# EAGLE design rf24 shield (EAGLE 6.1)
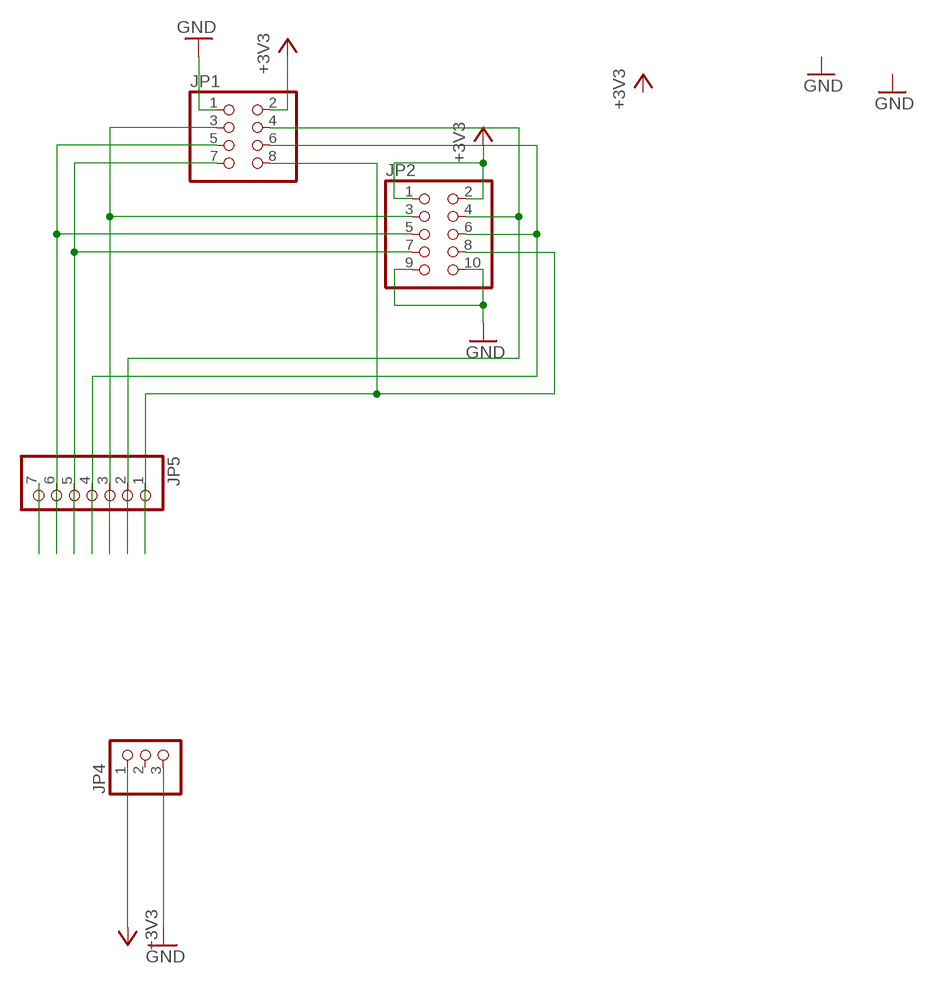
[diagram p0: schematic, sheet 1]

## Parts
JP1  PINHD-2X4  [2X04]
JP2  PINHD-2X5  [2X05]
JP4  PINHD-1X3  [1X03]
JP5  PINHD-1X7  [1X07]

## Nets
+3V3: JP1.2 JP2.1 JP2.2 JP4.1
GND: JP1.1 JP2.9 JP2.10 JP4.3
N$1: JP1.3 JP2.3 JP5.3
N$2: JP1.5 JP2.5 JP5.6
N$3: JP1.7 JP2.7 JP5.5
N$4: JP1.4 JP2.4 JP5.2
N$5: JP1.6 JP2.6 JP5.4
N$6: JP1.8 JP2.8 JP5.1
N$8: JP5.7
Unconnected: JP4.2

## Library data of the parts
JP1 = pinhead:PINHD-2X4: PIN HEADER
JP2 = pinhead:PINHD-2X5: PIN HEADER
JP4 = pinhead:PINHD-1X3: PIN HEADER
JP5 = pinhead:PINHD-1X7: PIN HEADER

## Board
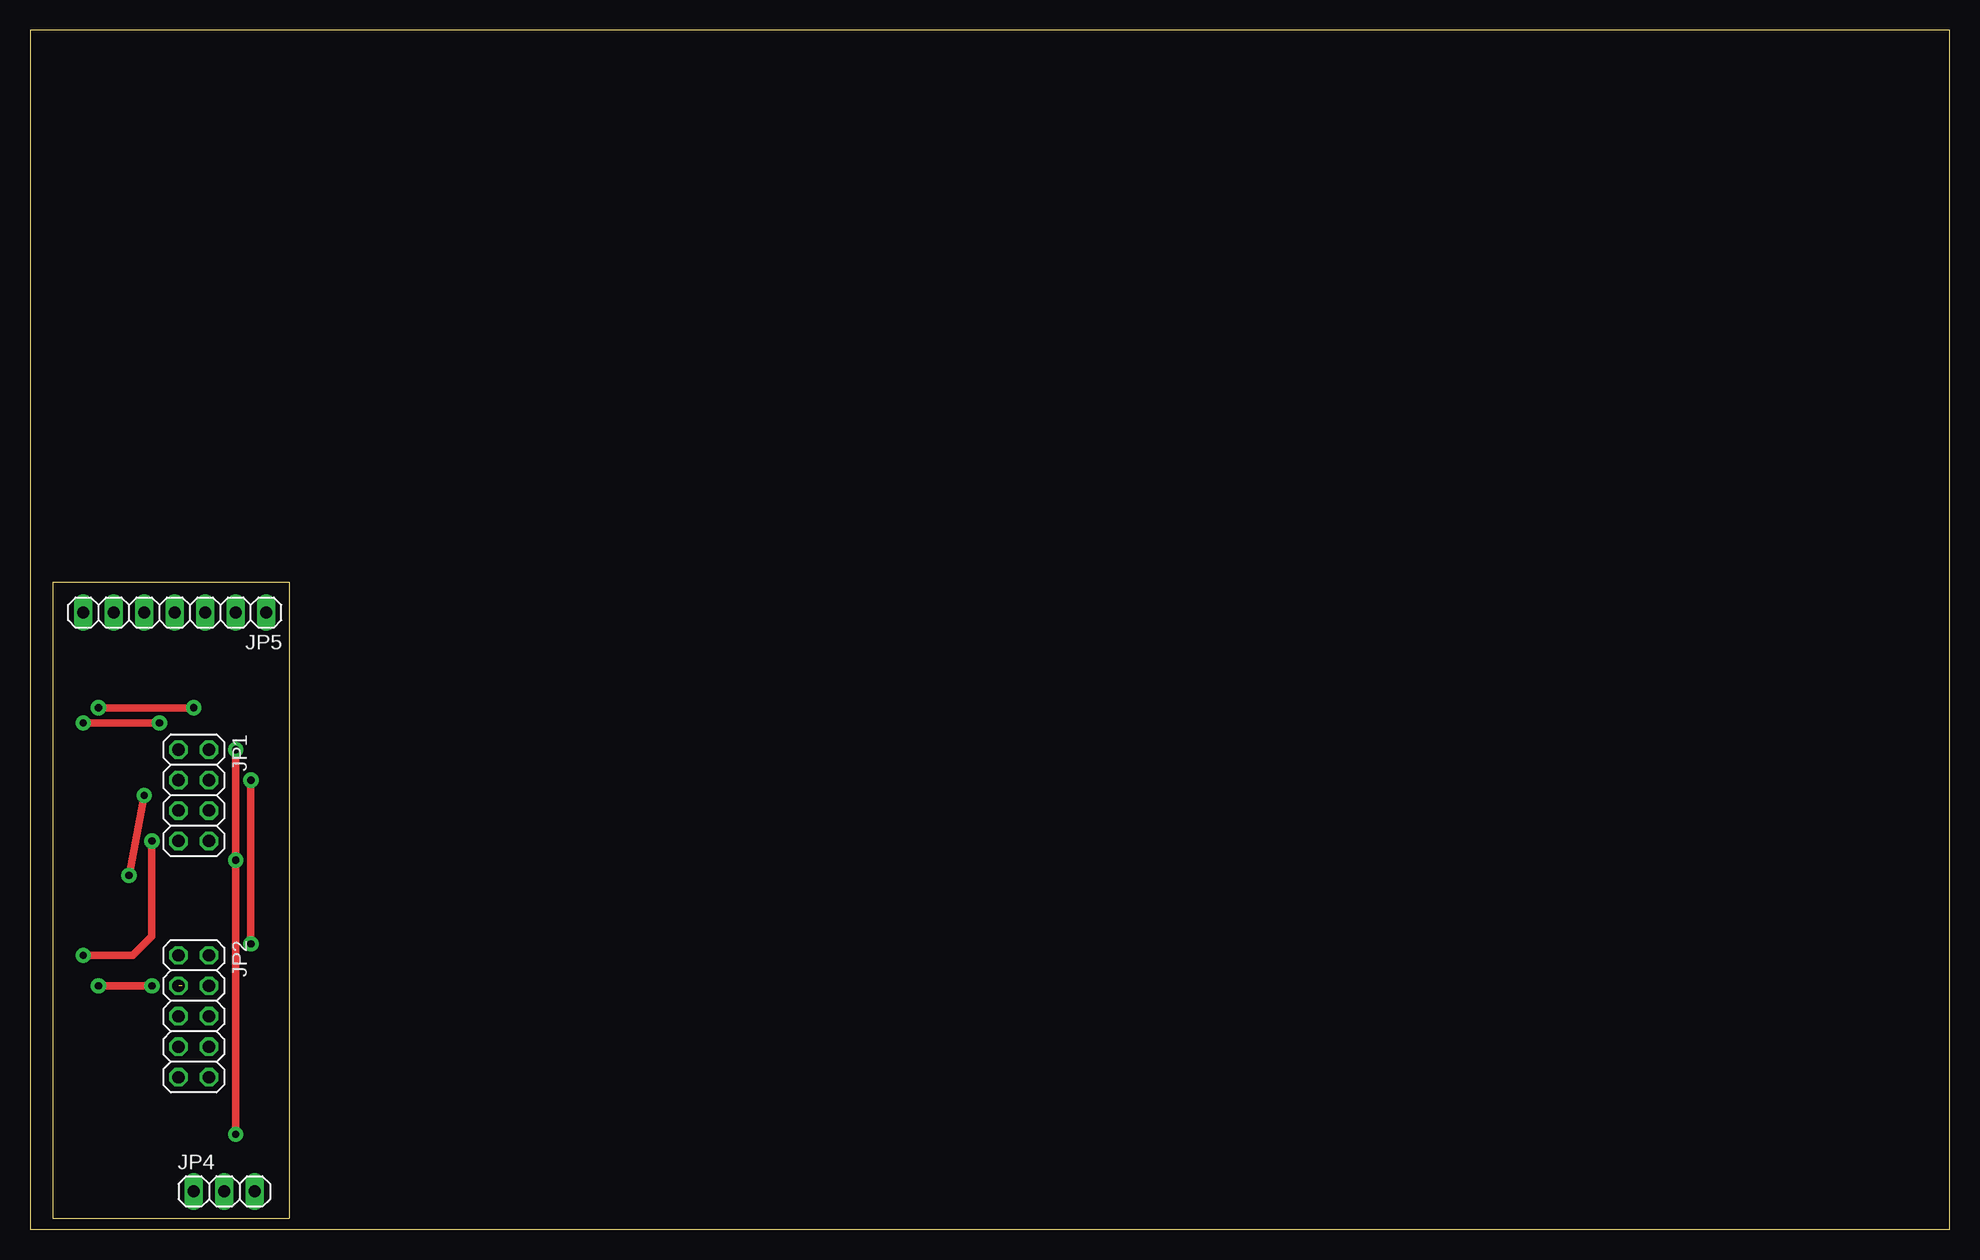
[diagram p1: board, top side]
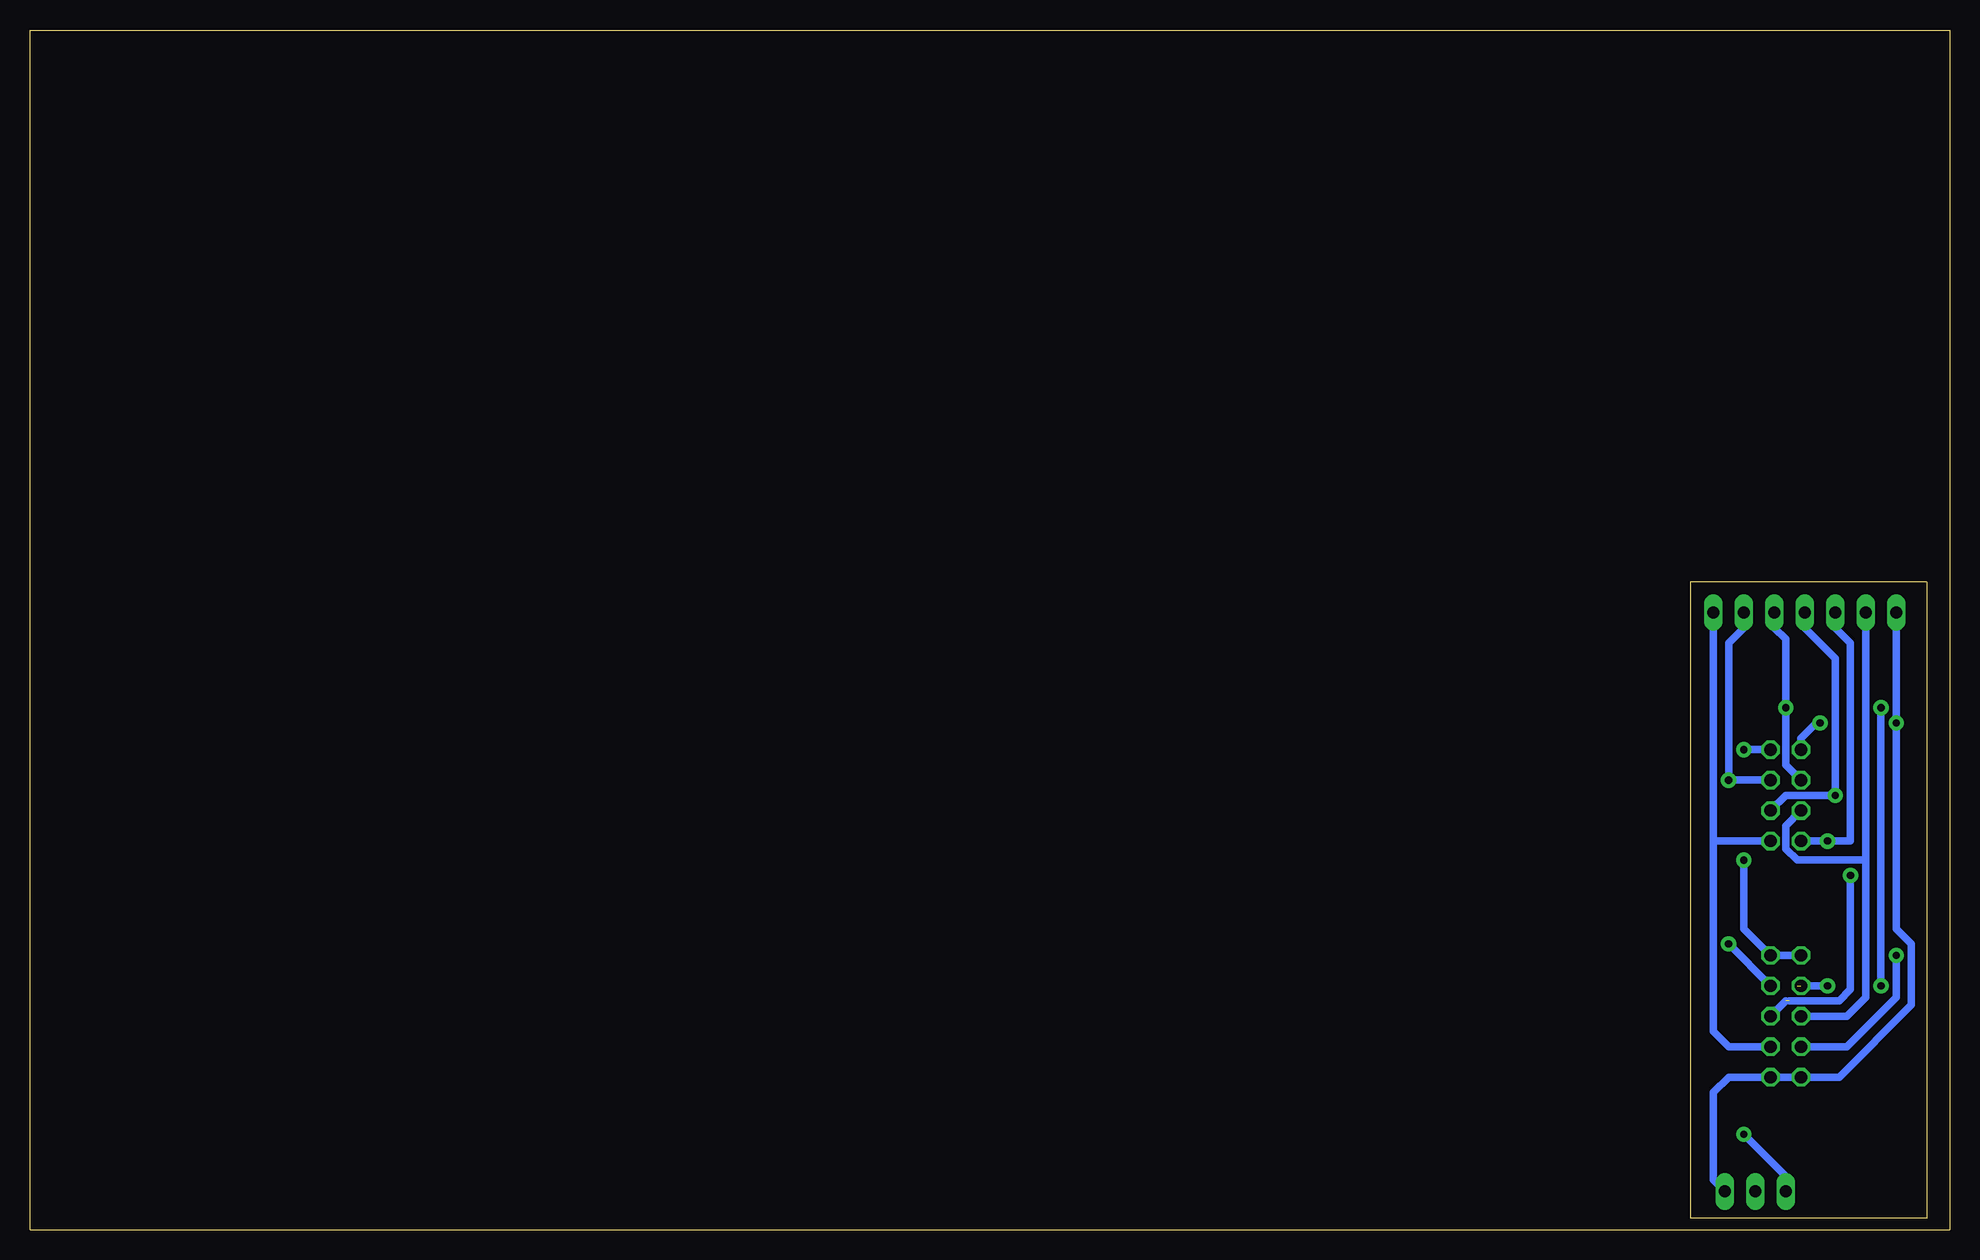
[diagram p2: board, bottom side, seen from below]

Size 160 x 100.01 mm. Coordinates in mm from the lower left corner, seen from the top.
Outline: 160,0.01 160,100.01 0,100.01 0,0.01
Outline: 1.91,53.97 1.91,0.97 21.59,0.97 21.59,53.97
Outline: 1.91,53.99 21.59,53.99
Outline: 160,0 0,0
Copper layers (1*16): Top 0.035mm / dielectric 1.5mm / Bottom 0.035mm
Design rules: minimum track width 10mil, minimum drill 24mil, track to track 8mil, track to pad 8mil, pad to pad 8mil, via to via 8mil, smd to smd 8mil, copper to edge 40mil, drill to drill 8mil, minimum pad ring 10mil, minimum via ring 8mil, stop-mask expansion 4mil, vias tented up to drill 0mil, thermal gap 10mil

### Footprints (pad centres in the part's own frame; a part is rotated, then mirrored left to right if it is on the bottom)
2X04 = drill 1.016 octagon: 1 -3.81,-1.27; 2 -3.81,1.27; 3 -1.27,-1.27; 4 -1.27,1.27; 5 1.27,-1.27; 6 1.27,1.27; 7 3.81,-1.27; 8 3.81,1.27
2X05 = drill 1.016 octagon: 1 -5.08,-1.27; 2 -5.08,1.27; 3 -2.54,-1.27; 4 -2.54,1.27; 5 0,-1.27; 6 0,1.27; 7 2.54,-1.27; 8 2.54,1.27; 9 5.08,-1.27; 10 5.08,1.27
1X03 = drill 1.016 long: 1 -2.54,0; 2 0,0; 3 2.54,0
1X07 = drill 1.016 long: 1 -7.62,0; 2 -5.08,0; 3 -2.54,0; 4 0,0; 5 2.54,0; 6 5.08,0; 7 7.62,0

### Placement (x,y rotation side)
JP1  13.65,36.21 270 top
JP2  13.65,17.79 270 top
JP4  16.19,3.19 0 top
JP5  12.06,51.45 180 top

### Tracks (layer width: path | path; a pad name or v marks a point on that pad's centre or on a via)
+3V3  (via drill 0.6 pad 1.27)
  Top 0.61: v17.14,40.02 v17.14,30.81 v17.14,7.95
  Bottom 0.61: JP1.2 v17.14,40.02 | JP2.1 JP2.2 17.14,25.09 v17.14,30.81 | JP4.1 13.65,4.46 v17.14,7.95
GND  (via drill 0.6 pad 1.27)
  Top 0.61: v4.45,42.24 v10.79,42.24
  Bottom 0.61: 4.51,41.99 v4.45,42.24 4.45,25.09 3.17,23.82 3.17,18.75 9.21,12.71 JP2.9 JP2.10 18.41,12.71 19.68,11.44 19.68,4.14 JP4.3 | v10.79,42.24 11.11,42.24 12.38,40.97 JP1.1
N$1  (via drill 0.6 pad 1.27)  (1 unrouted)
  Top 0.61: v13.65,43.51 v5.71,43.51 | v5.71,20.33 v10.16,20.33
  Bottom 0.61: JP1.3 13.65,38.75 v13.65,43.51 13.65,49.22 14.61,50.18 JP5.3 | v5.71,43.51 v5.71,20.33 | v10.16,20.33 12.7,20.33
N$2
  Bottom 0.61: JP2.5 8.57,17.79 6.99,19.38 6.99,30.81 | JP1.5 13.65,33.67 13.65,31.76 12.7,30.81 6.99,30.81 | 6.99,30.81 JP5.6
N$3  (via drill 0.6 pad 1.27)
  Top 0.61: v10.16,32.4 10.16,24.46 8.57,22.87 v4.45,22.87
  Bottom 0.61: JP1.7 v10.16,32.4 8.26,32.4 8.26,48.91 9.53,50.18 JP5.5 | v4.45,22.87 4.45,19.38 8.57,15.25 JP2.7
N$4  (via drill 0.6 pad 1.27)
  Top 0.61: v18.41,37.48 v18.41,23.82
  Bottom 0.61: JP1.4 v18.41,37.48 18.41,48.91 17.14,50.18 JP5.2 | v18.41,23.82 JP2.4
N$5  (via drill 0.6 pad 1.27)  (1 unrouted)
  Top 0.61: v8.26,29.54 v9.53,36.21
  Bottom 0.61: JP1.6 13.65,36.21 v9.53,36.21 9.53,47.64 12.06,50.18 JP5.4 | JP2.6 13.65,19.06 | v8.26,29.54 8.26,20.02 9.21,19.06 13.34,19.06
N$6
  Bottom 0.61: 19.68,32.4 19.68,16.52 18.41,15.25 JP2.8 | JP1.8 19.68,32.4 | 19.68,32.4 JP5.1
N$8
  Bottom 0.61: JP5.7 4.45,42.24